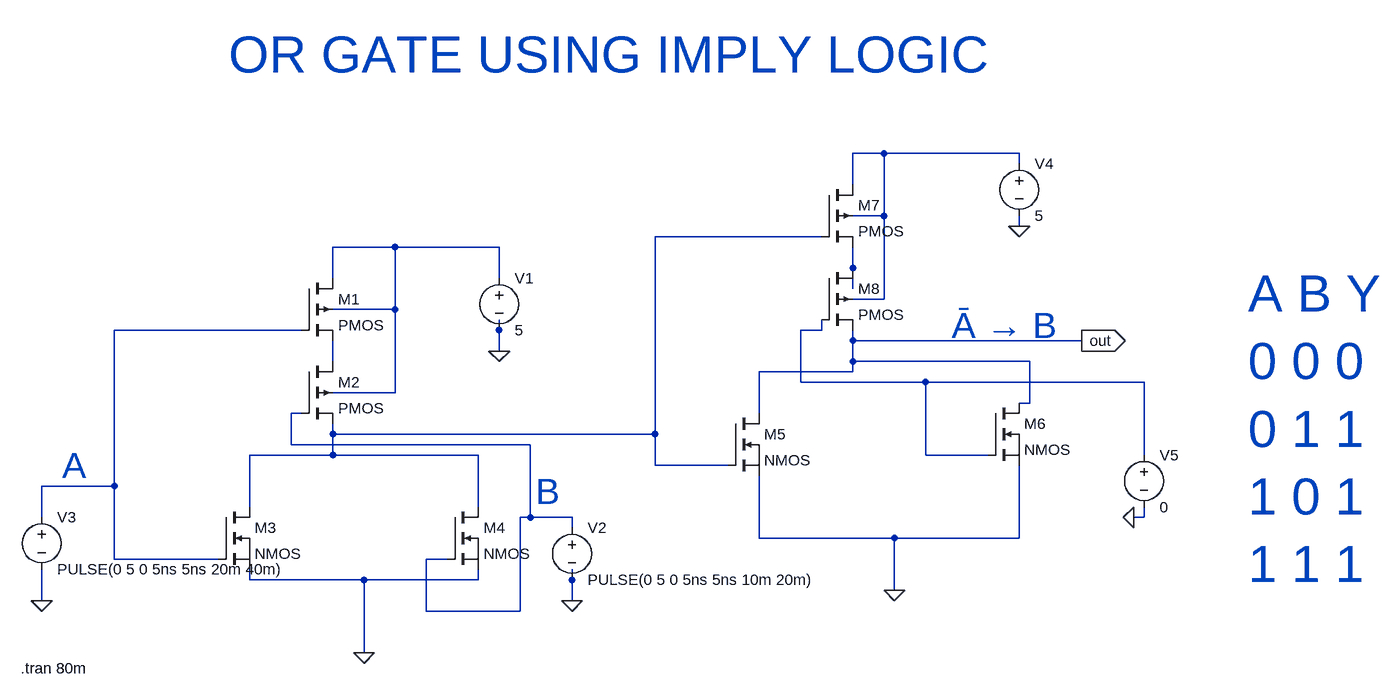
[diagram p0: schematic originalorgateimply.asc]
originalorgateimply.asc, the LTspice schematic file:
Version 4
SHEET 1 1928 1380
WIRE 1056 -160 1008 -160
WIRE 1264 -160 1056 -160
WIRE 1264 -144 1264 -160
WIRE 1008 -112 1008 -160
WIRE 1056 -64 1056 -160
WIRE 1056 -64 1008 -64
WIRE 1264 -48 1264 -64
WIRE 960 -32 704 -32
WIRE 304 -16 208 -16
WIRE 464 -16 304 -16
WIRE 1008 16 1008 -16
WIRE 208 32 208 -16
WIRE 464 32 464 -16
WIRE 1008 48 1008 16
WIRE 1056 64 1056 -64
WIRE 1056 64 1008 64
WIRE 304 80 304 -16
WIRE 304 80 208 80
WIRE 160 112 -128 112
WIRE 464 112 464 96
WIRE 960 112 960 96
WIRE 960 112 928 112
WIRE 1008 128 1008 112
WIRE 1360 128 1008 128
WIRE 464 144 464 112
WIRE 208 160 208 128
WIRE 1008 160 1008 128
WIRE 1280 160 1008 160
WIRE 1008 176 1008 160
WIRE 1008 176 864 176
WIRE 928 192 928 112
WIRE 1120 192 928 192
WIRE 1456 192 1120 192
WIRE 304 208 304 80
WIRE 304 208 208 208
WIRE 1280 224 1280 160
WIRE 1280 224 1264 224
WIRE 160 240 144 240
WIRE 864 240 864 176
WIRE 208 272 208 256
WIRE 704 272 704 -32
WIRE 704 272 208 272
WIRE 144 288 144 240
WIRE 512 288 144 288
WIRE 208 304 208 272
WIRE 208 304 80 304
WIRE 432 304 208 304
WIRE 1120 304 1120 192
WIRE 1216 304 1120 304
WIRE 1456 304 1456 192
WIRE 704 320 704 272
WIRE 816 320 704 320
WIRE -128 352 -128 112
WIRE -128 352 -240 352
WIRE 80 384 80 304
WIRE 432 384 432 304
WIRE -240 400 -240 352
WIRE 512 400 512 288
WIRE 512 400 496 400
WIRE 576 400 512 400
WIRE 1456 400 1456 384
WIRE 1456 400 1440 400
WIRE 576 416 576 400
WIRE 864 432 864 336
WIRE 1072 432 864 432
WIRE 1264 432 1264 320
WIRE 1264 432 1072 432
WIRE -128 464 -128 352
WIRE 32 464 -128 464
WIRE 384 464 352 464
WIRE 80 496 80 480
WIRE 256 496 80 496
WIRE 432 496 432 480
WIRE 432 496 256 496
WIRE 576 496 576 480
WIRE 1072 512 1072 432
WIRE -240 528 -240 480
WIRE 576 528 576 496
WIRE 352 544 352 464
WIRE 496 544 496 400
WIRE 496 544 352 544
WIRE 256 608 256 496
FLAG -240 528 0
FLAG 256 608 0
FLAG 464 144 0
FLAG 576 528 0
FLAG 1264 -48 0
FLAG 1072 512 0
FLAG 1440 400 0
FLAG 1360 128 out
IOPIN 1360 128 Out
SYMBOL pmos4 160 32 R0
SYMATTR InstName M1
SYMBOL pmos4 160 160 R0
SYMATTR InstName M2
SYMBOL nmos 32 384 R0
SYMATTR InstName M3
SYMBOL nmos 384 384 R0
SYMATTR InstName M4
SYMBOL voltage 464 16 R0
WINDOW 123 0 0 Left 0
WINDOW 39 0 0 Left 0
SYMATTR InstName V1
SYMATTR Value 5
SYMBOL voltage -240 384 R0
WINDOW 123 0 0 Left 0
WINDOW 39 0 0 Left 0
SYMATTR InstName V3
SYMATTR Value PULSE(0 5 0 5ns 5ns 20m 40m)
SYMBOL voltage 576 400 R0
WINDOW 123 0 0 Left 0
WINDOW 39 0 0 Left 0
SYMATTR InstName V2
SYMATTR Value PULSE(0 5 0 5ns 5ns 10m 20m)
SYMBOL nmos 816 240 R0
SYMATTR InstName M5
SYMBOL nmos 1216 224 R0
SYMATTR InstName M6
SYMBOL voltage 1264 -160 R0
WINDOW 123 0 0 Left 0
WINDOW 39 0 0 Left 0
SYMATTR InstName V4
SYMATTR Value 5
SYMBOL voltage 1456 288 R0
WINDOW 123 0 0 Left 0
WINDOW 39 0 0 Left 0
SYMATTR InstName V5
SYMATTR Value 0
SYMBOL pmos4 960 -112 R0
SYMATTR InstName M7
SYMBOL pmos4 960 16 R0
SYMATTR InstName M8
TEXT -272 632 Left 2 !.tran 80m
TEXT -208 320 Left 5 ;A
TEXT 520 360 Left 5 ;B
TEXT 48 -312 Left 6 ;OR GATE USING IMPLY LOGIC
TEXT 1160 104 Left 5 ;Ā → B
TEXT 1616 56 Left 6 ;A B Y\n0 0 0\n0 1 1\n1 0 1\n1 1 1

The netlist it stands for:
* originalorgateimply.asc
M1 N003 N005 N007 N003 PMOS
M2 N007 N008 N002 N003 PMOS
M3 N002 N005 0 0 NMOS
M4 N002 N008 0 0 NMOS
V1 N003 0 5
V3 N005 0 PULSE(0 5 0 5ns 5ns 20m 40m)
V2 N008 0 PULSE(0 5 0 5ns 5ns 10m 20m)
M5 out N002 0 0 NMOS
M6 out N006 0 0 NMOS
V4 N001 0 5
V5 N006 0 0
M7 N001 N002 N004 N001 PMOS
M8 N004 N006 out N001 PMOS
.model NMOS NMOS
.model PMOS PMOS
.lib standard.mos
.tran 80m
* A
* B
* OR GATE USING IMPLY LOGIC
* Ā → B
* A B Y
* 0 0 0
* 0 1 1
* 1 0 1
* 1 1 1
.backanno
.end